# Altium schematic sheet main_schematic.SchDoc
size Letter; DrawnBy: AIDAN SCHWING; SheetNumber: 1; SheetTotal: 2
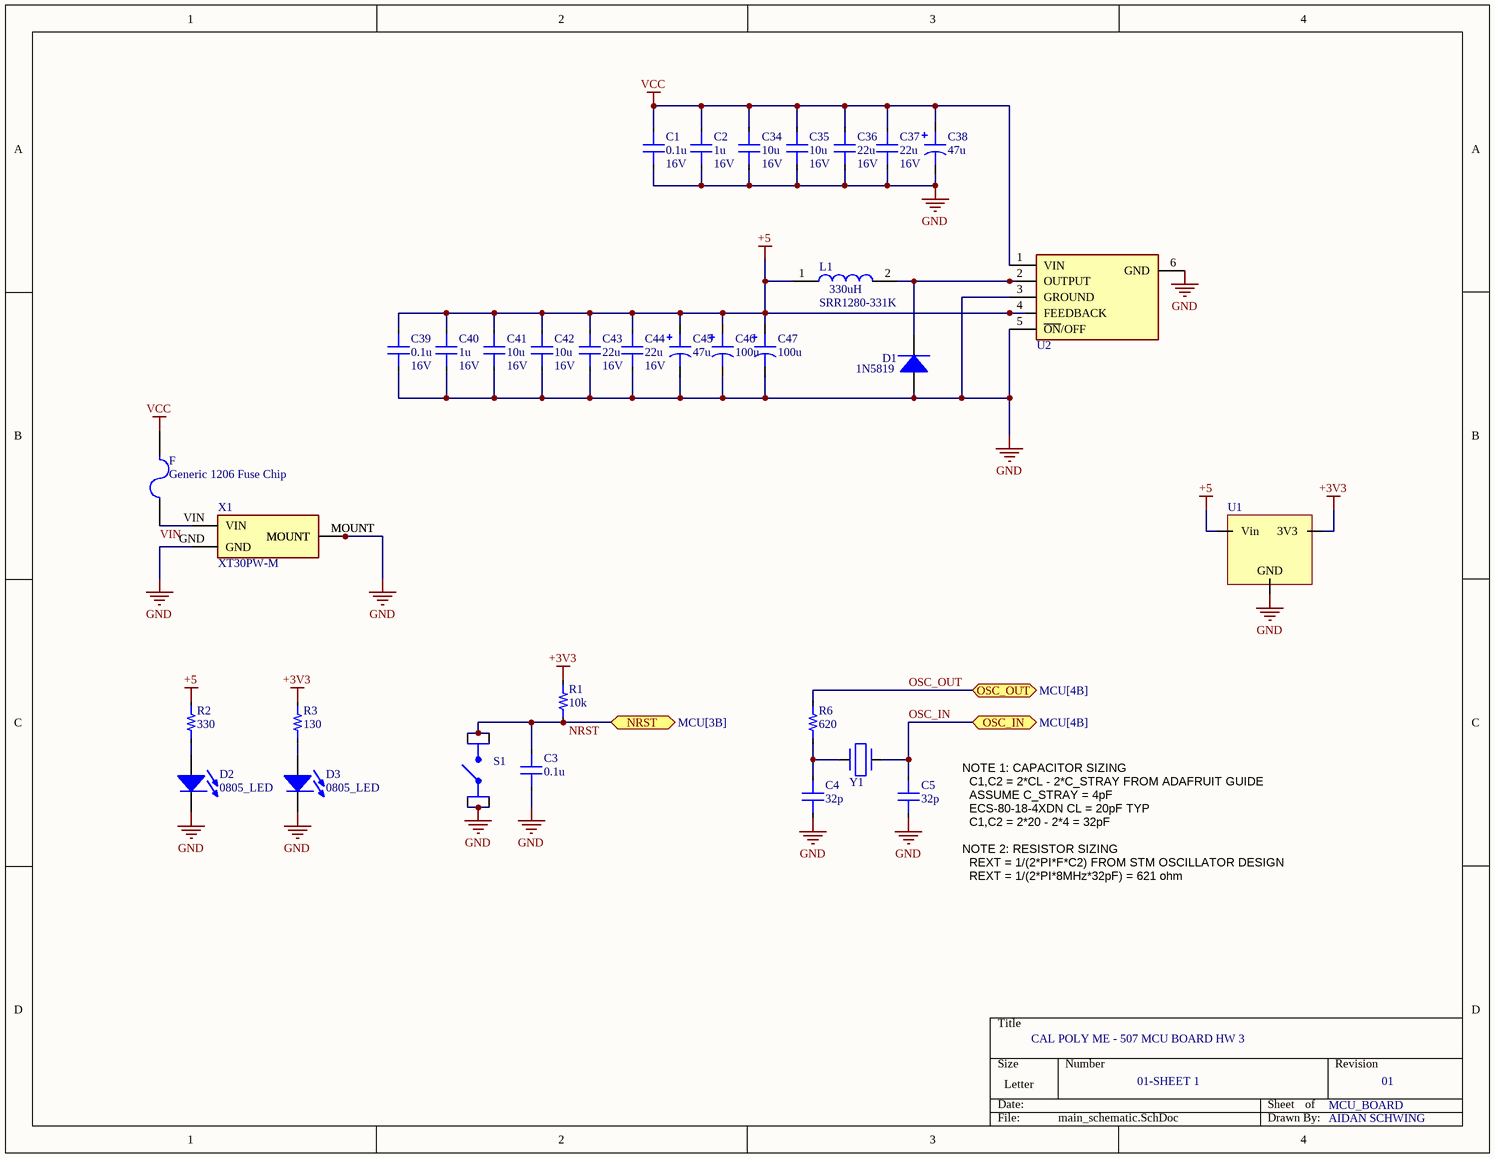
[diagram p0: main_schematic.SchDoc]

## Parts
C1  value 0.1u  Voltage: 16V  [0603_CAP]  (hidden comment: Capacitor)
C2  value 1u  Voltage: 16V  [0603_CAP]  (hidden comment: Capacitor)
C3  value 0.1u  [0805_CAP]  (hidden comment: Capacitor)
C4  value 32p  [0805_CAP]  (hidden comment: Capacitor)
C5  value 32p  [0805_CAP]  (hidden comment: Capacitor)
C34  value 10u  Voltage: 16V  [0805_CAP]  (hidden comment: Capacitor)
C35  value 10u  Voltage: 16V  [0805_CAP]  (hidden comment: Capacitor)
C36  value 22u  Voltage: 16V  [1210_CAP]  (hidden comment: Capacitor)
C37  value 22u  Voltage: 16V  [1210_CAP]  (hidden comment: Capacitor)
C38  value 47u  [6.60x6.60x8.00mm_E_CAP]  (hidden comment: UWT1H470MCL1GS)
C39  value 0.1u  Voltage: 16V  [0603_CAP]  (hidden comment: Capacitor)
C40  value 1u  Voltage: 16V  [0603_CAP]  (hidden comment: Capacitor)
C41  value 10u  Voltage: 16V  [0805_CAP]  (hidden comment: Capacitor)
C42  value 10u  Voltage: 16V  [0805_CAP]  (hidden comment: Capacitor)
C43  value 22u  Voltage: 16V  [1210_CAP]  (hidden comment: Capacitor)
C44  value 22u  Voltage: 16V  [1210_CAP]  (hidden comment: Capacitor)
C45  value 47u  [6.60x6.60x8.00mm_E_CAP]  (hidden comment: UWT1H470MCL1GS)
C46  value 100u  [6.60x6.60x8.00mm_E_CAP]  (hidden comment: 865080343009)
C47  value 100u  [6.60x6.60x8.00mm_E_CAP]  (hidden comment: 865080343009)
D1  1N5819  [SOD-123F]
D2  0805_LED  [0805_LED]
D3  0805_LED  [0805_LED]
F  Generic 1206 Fuse Chip  [1206_RES]
L1  SRR1280-331K  [SRR1280-150M]
R1  value 10k  [0603_RES]  (hidden comment: Resistor)
R2  value 330  [0603_RES]  (hidden comment: Resistor)
R3  value 130  [0603_RES]  (hidden comment: Resistor)
R6  value 620  [0805_RES]  (hidden comment: Resistor)
S1  TactileSwitch  [6mmTactileSwitch_ThroughHole]  (value not drawn)
U1  (no value)  [DPAK3_TO-252-3]
U2  LM2576-5.0WU  [MICROCHIP_TO-263]  (value not drawn)
X1  XT30PW-M  [XT30PWM]
Y1  ECS-80-18-4XDN  [ECS-80-18]  (value not drawn)

## Ports
NRST (bidir, see MCU[3B]), OSC_IN (bidir, see MCU[4B]), OSC_OUT (bidir, see MCU[4B])

## Nets
+3V3: R1.2 R3.2 U1.4(3V3)
+5: C39.1 C40.1 C41.1 C42.1 C43.1 C44.1 C45.1 C46.1 C47.1 L1.1 R2.2 U1.3(Vin) U2.4(FEEDBACK)
GND: C1.2 C2.2 C3.1 C4.1 C5.1 C34.2 C35.2 C36.2 C37.2 C38.2 C39.2 C40.2 C41.2 C42.2 C43.2 C44.2 C45.2 C46.2 C47.2 D1.2 D2.2(K) D3.2(K) S1.1 S1.2 U1.1(GND) U2.3(GROUND) U2.5(~{ON}/OFF) U2.6(GND) X1.GND X1.MOUNT
VCC: C1.1 C2.1 C34.1 C35.1 C36.1 C37.1 C38.1 F.2 U2.1(VIN)
NRST: C3.2 R1.1 S1.3 S1.4 ; port NRST
OSC_IN: C5.2 Y1.2 ; port OSC_IN
OSC_OUT: R6.2 ; port OSC_OUT
VIN: F.1 X1.VIN
NetC4_2: C4.2 R6.1 Y1.1
NetD1_1: D1.1 L1.2 U2.2(OUTPUT)
NetD2_1: D2.1(A) R2.1
NetD3_1: D3.1(A) R3.1

## Notes on the sheet
- (near C5) NOTE 1: CAPACITOR SIZING
  C1,C2 = 2*CL - 2*C_STRAY FROM ADAFRUIT GUIDE
  ASSUME C_STRAY = 4pF
  ECS-80-18-4XDN CL = 20pF TYP
  C1,C2 = 2*20 - 2*4 = 32pF
  NOTE 2: RESISTOR SIZING
  REXT = 1/(2*PI*F*C2) FROM STM OSCILLATOR DESIGN
  REXT = 1/(2*PI*8MHz*32pF) = 621 ohm
- CAL POLY ME - 507 MCU BOARD HW 3
- 01-SHEET 1
- MCU_BOARD
- 01
- AIDAN SCHWING

## Library data of the parts
C38 C45 = UWT1H470MCL1GS: Percent Tolerance: 20; Dielectric: *; ESR: *; ComponentLink1Description: Digikey; ComponentLink1URL: https://www.digikey.com/product-detail/en/nichicon/UWT1H470MCL1GS/493-2225-1-ND/590200
C46 C47 = 865080343009: CAP ALUM 100UF 20% 16V SMD; Percent Tolerance: 20; Dielectric: *; ESR: *; ComponentLink1Description: Digikey; ComponentLink1URL: https://www.digikey.com/en/products/detail/w%C3%BCrth-elektronik/865080343009/5728014
D1 = 1N5819: Diode Super Barrier 40V 1A Surface Mount SOD-123F; Num_Circuits: 1; Vr: 40V; Package: SOD-123F; ComponentLink1Description: Digikey; ComponentLink1URL: https://www.digikey.com/product-detail/en/diodes-incorporated/1N5819HW1-7-F/1N5819HW1-7-FDITR-ND/5768523
D2 D3 = 0805_LED: Generic 0805 LED
L1 = SRR1280-331K: Power Inductors - SMD 330uH 10% SMD 1280; MfrPartNo: 652-SRR1280-331K; iMax: 1.1A; Resistance: 600mOhm; Link: https://www.mouser.com/ProductDetail/Bourns/SRR1280-331K?qs=brMhP%2FMjUfd0KI3Wq6D0xQ%3D%3D; Name: SRR1280-331K; Package: 5050; Inductance: 330uH
S1 = TactileSwitch: Generic 6mm Through Hole Tactile Switch; Current: 0.05A; MaxVoltage: 12V; Pole: 1; Name: TactileSwitch; Mounting: TH; ComponentLink1Description: Digikey; ComponentLink1URL: https://www.digikey.com/en/products/detail/c-k/PTS645SH95-2-LFS/1146763
U1 = NCP1117DT33T5G: IC REG LINEAR 3.3V 1A DPAK
U2 = LM2576-5.0WU: Switching Voltage Regulators 3A Step-Down SMPS Regulator; Manufacturer_Name: Microchip; Datasheet Link: http://ww1.microchip.com/downloads/en/DeviceDoc/lm2576.pdf; Manufacturer_Part_Number: LM2576-5.0WU; Mouser Part Number: 998-LM2576-5.0WU; Mouser Price/Stock: https://www.mouser.co.uk/ProductDetail/Microchip-Technology/LM2576-5.0WU?qs=kh6iOki%2FeLHlI9xhWDTjJw%3D%3D; Arrow Part Number: LM2576-5.0WU; Arrow Price/Stock: https://www.arrow.com/en/products/lm2576-5.0wu/microchip-technology?region=nac
X1 = XT30PW-M: Socket; DC supply; XT30; male; PIN: 2; on PCBs; THT; yellow; 15A; 500V; Manufacturer_Name: Amass; Datasheet Link: https://www.tme.eu/sl/Document/ce4077e36b79046da520ca73227e15de/XT30PW%20SPEC.pdf; Height: 5mm; Manufacturer_Part_Number: XT30PW-M
Y1 = ECS-80-18-4XDN: Crystals 8MHz 18pF EX/TEMP HC-49US; ComponentLink1Description: Mouser; ComponentLink1URL: https://www.mouser.com/ProductDetail/ECS/ECS-80-18-4XDN?qs=CkbNAJEAr%2FRohZNNeAgxsQ%3D%3D
C1-C5 C34-C37 C39-C44 = Capacitor: Dielectric: *; Percent Tolerance: *; ESR: *
R1-R3 R6 = Resistor: Tolerance: *